# EAGLE schematic Nano_V2-2 (EAGLE 9.6.2)
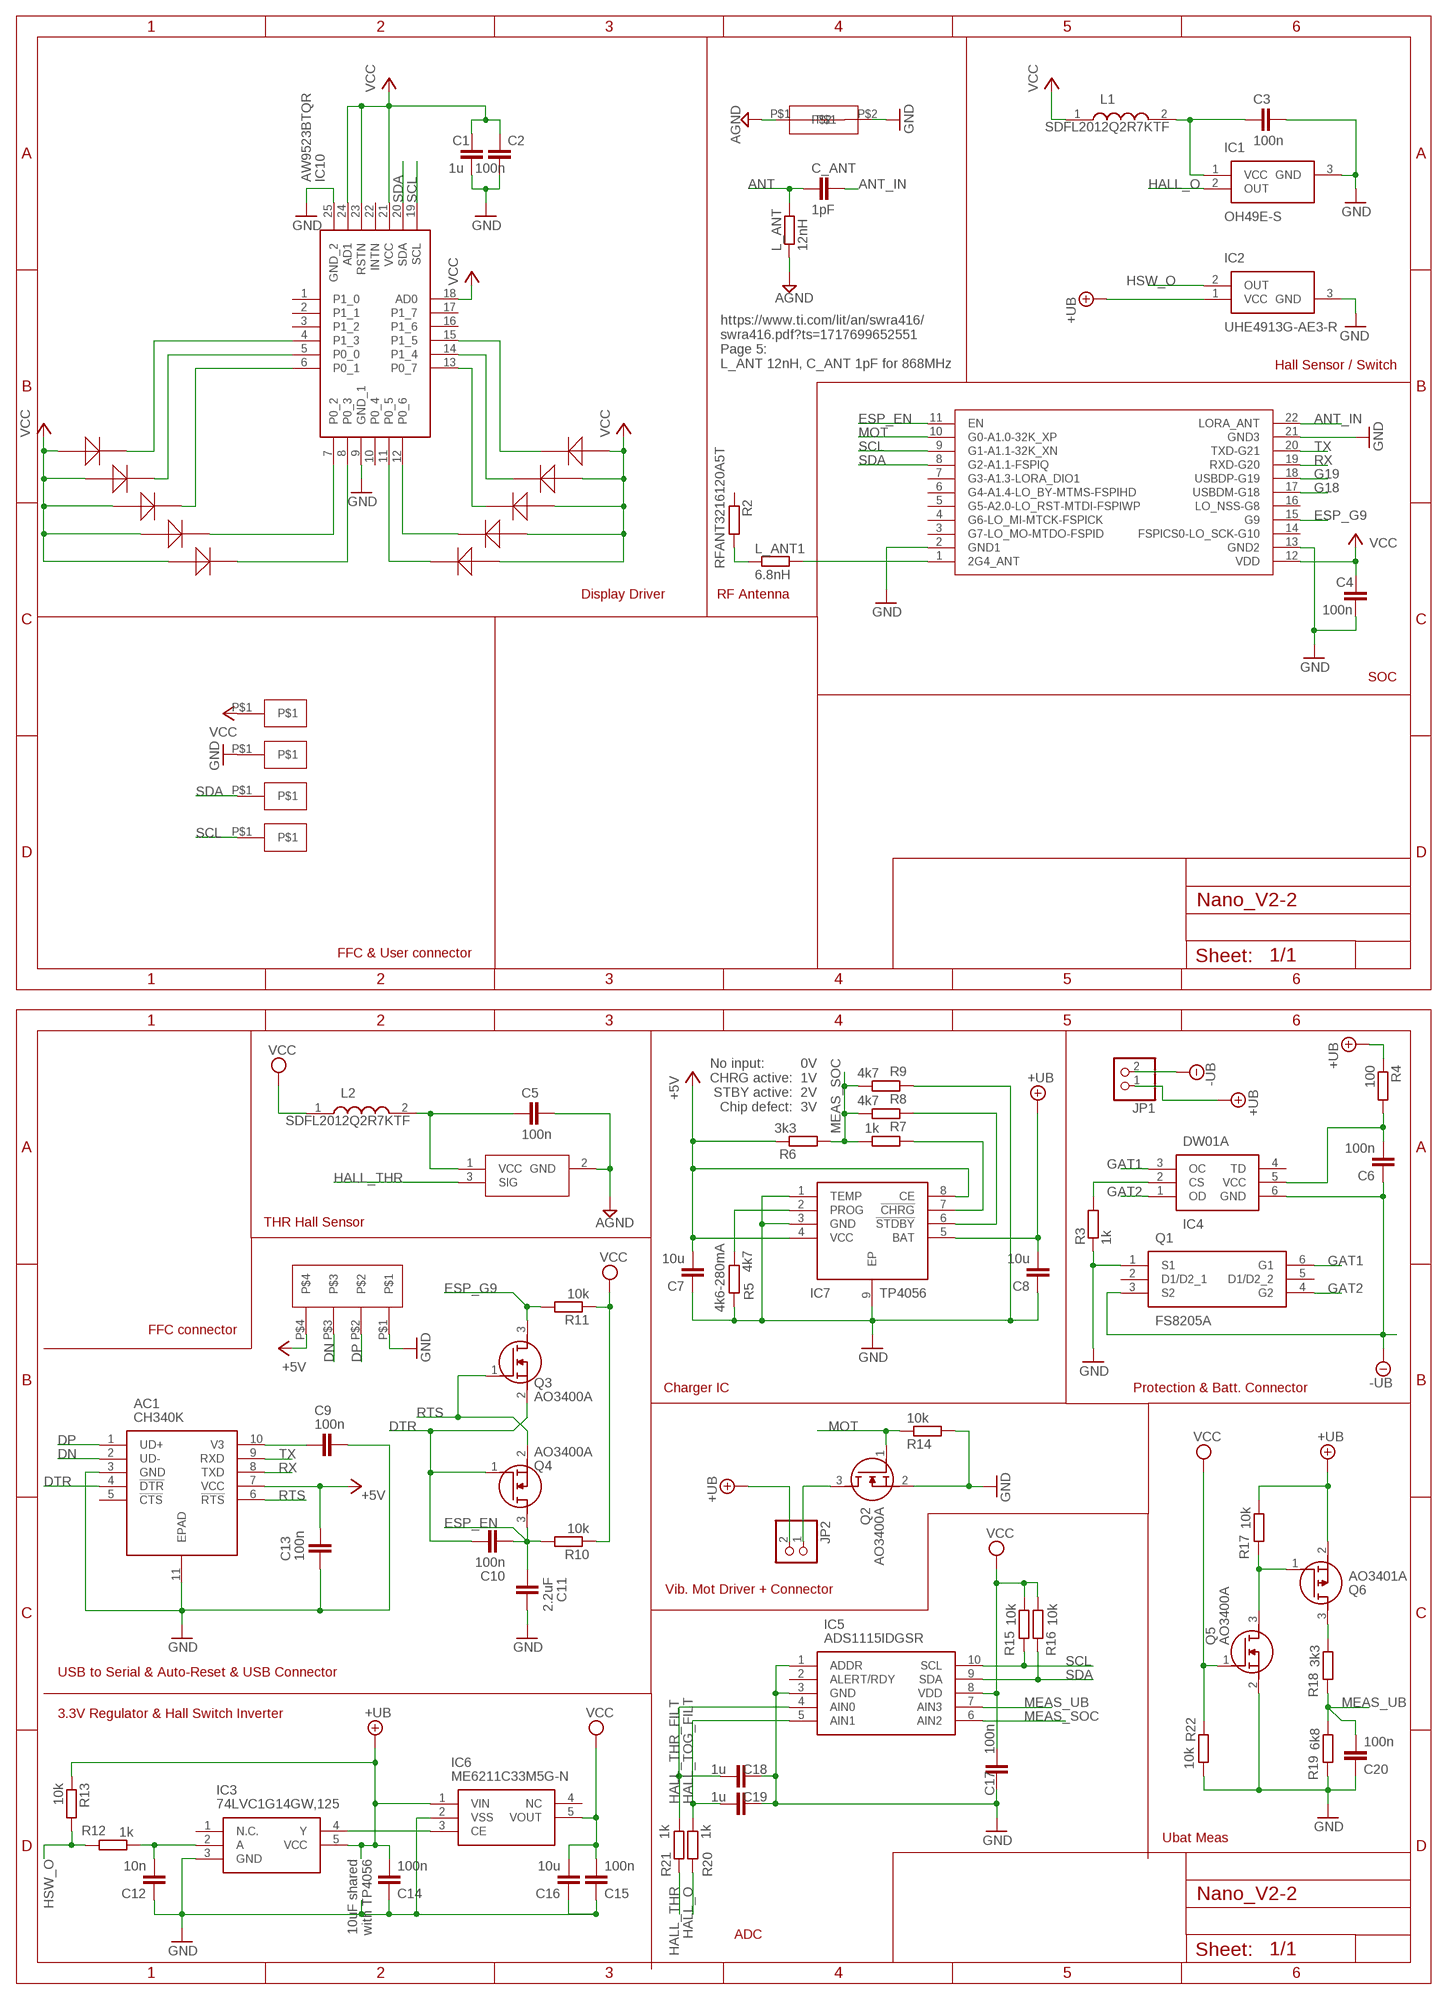
[diagram p0: schematic, sheet 1]

## Parts
AC1  CH340K  [SOP100P600X180-11N]
C1  1u  C-EUC0603  [C0603]
C2  100n  C-EUC0603  [C0603]
C3  100n  C-EUC0603  [C0603]
C4  100n  C-EUC0603  [C0603]
C5  100n  C-EUC0603  [C0603]
C6  100n  C-EUC0603  [C0603]
C7  10u  C-EUC0603  [C0603]
C8  10u  C-EUC0603  [C0603]
C9  100n  C-EUC0603  [C0603]
C10  100n  C-EUC0603  [C0603]
C11  2.2uF  C-EUC0603  [C0603]
C12  10n  C-EUC0603  [C0603]
C13  100n  C-EUC0603  [C0603]
C14  100n  C-EUC0603  [C0603]
C15  100n  C-EUC0603  [C0603]
C16  10u  C-EUC0603  [C0603]
C17  100n  C-EUC0603  [C0603]
C18  1u  C-EUC0603  [C0603]
C19  1u  C-EUC0603  [C0603]
C20  100n  C-EUC0603  [C0603]
C_ANT  1pF  C-EUC0402  [C0402]
IC1  OH49E-S  DRV5055A3QDBZR  [SOT95P237X112-3N]
IC2  UHE4913G-AE3-R  DRV5055A3QDBZR  [SOT95P237X112-3N]
IC3  74LVC1G14GW,125  [SOT65P212X110-5N]
IC4  DW01A  DW01A-G  [SOT95P280X135-6N]
IC5  ADS1115IDGSR  [SOP50P490X110-10N]
IC6  ME6211C33M5G-N  ME6211C50M5G  [SOT95P282X145-5N]
IC7  TP4056  TP4056-42-ESOP8  [SOIC127P600X175-9N]
IC10  AW9523BTQR  [QFN50P400X400X80-25N]
JP1  PINHD-1X2  [1X02]
JP2  PINHD-1X2  [1X02]
L1  SDFL2012Q2R7KTF  [INDC2112X105N]
L2  SDFL2012Q2R7KTF  [INDC2112X105N]
L_ANT  12nH  R-EU_R0402  [R0402]
L_ANT1  6.8nH  R-EU_R0402  [R0402]
Q1  FS8205A  [SOT95P280X125-6N]
Q2  AO3400A  [SOT95P280X125-3N]
Q3  AO3400A  [SOT95P280X125-3N]
Q4  AO3400A  [SOT95P280X125-3N]
Q5  AO3400A  [SOT95P280X125-3N]
Q6  AO3401A  [SOT95P280X125-3N]
R2  RFANT3216120A5T  R-EU_R1206  [R1206]
R3  1k  R-EU_R0603  [R0603]
R4  100  R-EU_R0603  [R0603]
R5  4k7  R-EU_R0603  [R0603]
R6  3k3  R-EU_R0603  [R0603]
R7  1k  R-EU_R0603  [R0603]
R8  4k7  R-EU_R0603  [R0603]
R9  4k7  R-EU_R0603  [R0603]
R10  10k  R-EU_R0603  [R0603]
R11  10k  R-EU_R0603  [R0603]
R12  1k  R-EU_R0603  [R0603]
R13  10k  R-EU_R0603  [R0603]
R14  10k  R-EU_R0603  [R0603]
R15  10k  R-EU_R0603  [R0603]
R16  10k  R-EU_R0603  [R0603]
R17  10k  R-EU_R0603  [R0603]
R18  3k3  R-EU_R0603  [R0603]
R19  6k8  R-EU_R0603  [R0603]
R20  1k  R-EU_R0603  [R0603]
R21  1k  R-EU_R0603  [R0603]
R22  10k  R-EU_R0603  [R0603]
U$1  LED_3MM_BIG_HOLE  [3MM_BIG_HOLE]
U$2  LED_3MM_BIG_HOLE  [3MM_BIG_HOLE]
U$3  LED_3MM_BIG_HOLE  [3MM_BIG_HOLE]
U$4  LED_3MM_BIG_HOLE  [3MM_BIG_HOLE]
U$5  HT-CT62  [HT-CT62]
U$6  LED_3MM_BIG_HOLE  [3MM_BIG_HOLE]
U$7  NETTIE_0.6MM  [0.6MM]
U$8  OH49  [OH49]
U$9  LED_3MM_BIG_HOLE  [3MM_BIG_HOLE]
U$10  LED_3MM_BIG_HOLE  [3MM_BIG_HOLE]
U$11  LED_3MM_BIG_HOLE  [3MM_BIG_HOLE]
U$12  1P  [1PAD]
U$13  1P  [1PAD]
U$14  4P  [4PAD]
U$15  LED_3MM_BIG_HOLE  [3MM_BIG_HOLE]
U$16  LED_3MM_BIG_HOLE  [3MM_BIG_HOLE]
U$17  1P  [1PAD]
U$18  1P  [1PAD]

## Nets
+5V: AC1.7(VCC) C7.2 C13.1 IC7.4(VCC) IC7.8(CE) R6.2 U$14.P$4
+UB: C8.2 C14.2 IC2.1(VCC) IC3.5(VCC) IC6.1(VIN) IC7.5(BAT) JP1.1 JP2.2 Q6.2(S) R4.1 R13.1 R17.1
-UB: C6.1 IC4.6(GND) JP1.2 Q1.3(S2)
AGND: C5.1 L_ANT.1 U$7.P$1 U$8.2(GND)
ANT: C_ANT.1 L_ANT.2
ANT_IN: C_ANT.2 U$5.22(LORA_ANT)
DN: AC1.2(UD-) U$14.P$3
DP: AC1.1(UD+) U$14.P$2
DTR: AC1.4(!DTR) C10.1 Q3.2(S) Q4.1(G)
ESP_EN: C10.2 C11.2 Q4.3(D) R10.2 U$5.11(EN)
ESP_G9: Q3.3(D) R11.2 U$5.15(G9)
G18: U$5.17(USBDM-G18)
G19: U$5.18(USBDP-G19)
GAT1: IC4.3(OC) Q1.6(G1)
GAT2: IC4.1(OD) Q1.4(G2)
GND: AC1.3(GND) AC1.11(EPAD) C1.2 C2.2 C3.1 C4.2 C7.1 C8.1 C9.1 C11.1 C12.1 C13.2 C14.1 C15.1 C16.1 C17.2 C18.2 C19.2 C20.1 IC1.3(GND) IC2.3(GND) IC3.3(GND) IC5.1(ADDR) IC5.3(GND) IC6.2(VSS) IC7.1(TEMP) IC7.3(GND) IC7.9(EP) IC10.9(GND_1) IC10.25(GND_2) Q1.1(S1) Q2.2(S) Q5.2(S) R3.1 R5.1 R9.1 R14.2 R19.2 R22.1 U$5.2(GND1) U$5.13(GND2) U$5.21(GND3) U$7.P$2 U$13.P$1 U$14.P$1
HALL_O: IC1.2(OUT) R20.2
HALL_THR: R21.2 U$8.3(SIG)
HALL_THR_FILT: C18.1 IC5.4(AIN0) R21.1
HALL_TOG_FILT: C19.1 IC5.5(AIN1) R20.1
HALL_V: C3.2 IC1.1(VCC) L1.2
HSW_O: IC2.2(OUT) R12.2 R13.2
MEAS_SOC: IC5.6(AIN2) R6.1 R7.2 R8.2 R9.2
MEAS_UB: C20.2 IC5.7(AIN3) R18.2 R19.1
MOT: Q2.1(G) R14.1 U$5.10(G0-A1.0-32K_XP)
N$1: L_ANT1.2 R2.2
N$2: L_ANT1.1 U$5.1(2G4_ANT)
N$3: IC10.11(P0_5) U$1.P$2(K)
N$4: IC10.12(P0_6) U$2.P$2(K)
N$5: IC10.13(P0_7) U$4.P$2(K)
N$6: IC10.14(P1_4) U$6.P$2(K)
N$7: IC10.15(P1_5) U$3.P$2(K)
N$9: IC10.8(P0_3) U$9.P$2(K)
N$10: IC10.7(P0_2) U$10.P$2(K)
N$11: IC10.6(P0_1) U$11.P$2(K)
N$12: IC10.5(P0_0) U$15.P$2(K)
N$13: IC10.4(P1_3) U$16.P$2(K)
N$20: IC7.2(PROG) R5.2
N$21: C6.2 IC4.5(VCC) R4.2
N$22: AC1.10(V3) C9.2
N$23: IC7.7(!CHRG) R7.1
N$24: IC4.2(CS) R3.2
N$25: IC7.6(!STDBY) R8.1
N$26: IC3.4(Y) IC6.3(CE)
N$27: C5.2 L2.2 U$8.1(VCC)
N$28: C12.2 IC3.2(A) R12.1
N$29: JP2.1 Q2.3(D)
N$32: Q5.3(D) Q6.1(G) R17.2
N$34: Q6.3(D) R18.1
RTS: AC1.6(!RTS) Q3.1(G) Q4.2(S)
RX: AC1.8(TXD) U$5.19(RXD-G20)
SCL: IC5.10(SCL) IC10.19(SCL) R15.2 U$5.9(G1-A1.1-32K_XN) U$18.P$1
SDA: IC5.9(SDA) IC10.20(SDA) R16.2 U$5.8(G2-A1.1-FSPIQ) U$17.P$1
TX: AC1.9(RXD) U$5.20(TXD-G21)
VCC: C1.1 C2.1 C4.1 C15.2 C16.2 C17.1 IC5.8(VDD) IC6.5(VOUT) IC10.18(AD0) IC10.21(VCC) IC10.23(RSTN) IC10.24(AD1) L1.1 L2.1 Q5.1(G) R10.1 R11.1 R15.1 R16.1 R22.2 U$1.P$1(A) U$2.P$1(A) U$3.P$1(A) U$4.P$1(A) U$5.12(VDD) U$6.P$1(A) U$9.P$1(A) U$10.P$1(A) U$11.P$1(A) U$12.P$1 U$15.P$1(A) U$16.P$1(A)
Unconnected: AC1.5(!CTS) IC3.1(N.C.) IC4.4(TD) IC5.2(ALERT/RDY) IC6.4(NC) IC10.1(P1_0) IC10.2(P1_1) IC10.3(P1_2) IC10.10(P0_4) IC10.16(P1_6) IC10.17(P1_7) IC10.22(INTN) Q1.2(D1/D2_1) Q1.5(D1/D2_2) R2.1 U$5.3(G7-LO_MO-MTDO-FSPID) U$5.4(G6-LO_MI-MTCK-FSPICK) U$5.5(G5-A2.0-LO_RST-MTDI-FSPIWP) U$5.6(G4-A1.4-LO_BY-MTMS-FSPIHD) U$5.7(G3-A1.3-LORA_DIO1) U$5.14(FSPICS0-LO_SCK-G10) U$5.16(LO_NSS-G8)

## Notes on the sheet
- Hall Sensor / Switch
- https://www.ti.com/lit/an/swra416/
  swra416.pdf?ts=1717699652551
  Page 5:
  L_ANT 12nH, C_ANT 1pF for 868MHz
- Display Driver | RF Antenna
- SOC
- FFC & User connector
- No input:         0V
  CHRG active:  1V
  STBY active:  2V
  Chip defect:  3V
- THR Hall Sensor
- 4k6-280mA
- FFC connector
- Charger IC | Protection & Batt. Connector
- Vib. Mot Driver + Connector
- USB to Serial & Auto-Reset & USB Connector
- 3.3V Regulator & Hall Switch Inverter
- Ubat Meas
- 10uF shared
  with TP4056
- ADC

## Library data of the parts
AC1 = CH340K:CH340K: CH340 USB2Serial Source: Datasheet <https://akizukidenshi.com/download/ds/wch/ch340.pdf>; DESCRIPTION: CH340 USB2Serial; HEIGHT: 1.8mm; MANUFACTURER_NAME: WCH; MANUFACTURER_PART_NUMBER: CH340K
C1-C20 C_ANT = rcl:C-EU: CAPACITOR, European symbol; SPICEPREFIX: C
IC1 IC2 = DRV5055A3QDBZR:DRV5055A3QDBZR: Hall Effect Sensor 1mA Ratiometric 3.3V/5V 3-Pin SOT-23 T/R Source: Datasheet <http://www.ti.com/general/docs/suppproductinfo.tsp?distId=10&gotoUrl=http://www.ti.com/lit/gpn/drv5055>; ARROW_PART_NUMBER: DRV5055A3QDBZR; ARROW_PRICE-STOCK: https://www.arrow.com/en/products/drv5055a3qdbzr/texas-instruments; DESCRIPTION: Hall Effect Sensor 1mA Ratiometric 3.3V/5V 3-Pin SOT-23 T/R; HEIGHT: 1.12mm; MANUFACTURER_NAME: Texas Instruments; MANUFACTURER_PART_NUMBER: DRV5055A3QDBZR; MOUSER_PART_NUMBER: 595-DRV5055A3QDBZR; MOUSER_PRICE-STOCK: https://www.mouser.co.uk/ProductDetail/Texas-Instruments/DRV5055A3QDBZR?qs=rrS6PyfT74dO6qwrOH6T8w%3D%3D
IC3 = 74LVC1G14GW_125:74LVC1G14GW,125: 74LVC1G14GW,125, Schmitt Trigger Inverter, LVC, 32mA 1.65 to 5.5V 5-Pin TSSOP Source: Datasheet <https://assets.nexperia.com/documents/data-sheet/74LVC1G14.pdf>; ARROW_PART_NUMBER: 74LVC1G14GW,125; ARROW_PRICE-STOCK: https://www.arrow.com/en/products/74lvc1g14gw125/nexperia?region=nac; DESCRIPTION: 74LVC1G14GW,125, Schmitt Trigger Inverter, LVC, 32mA 1.65 to 5.5V 5-Pin TSSOP; HEIGHT: 1.1mm; MANUFACTURER_NAME: Nexperia; MANUFACTURER_PART_NUMBER: 74LVC1G14GW,125; MOUSER_PART_NUMBER: 771-74LVC1G14GW-G; MOUSER_PRICE-STOCK: https://www.mouser.co.uk/ProductDetail/Nexperia/74LVC1G14GW125?qs=me8TqzrmIYVaj3J%252BEdq4Gw%3D%3D
IC4 = DW01A-G:DW01A-G: One Cell Lithium-ion/Polymer Battery Protection IC Source: Datasheet <http://acoptex.com/uploads/DW01A.pdf>; DESCRIPTION: One Cell Lithium-ion/Polymer Battery Protection IC; HEIGHT: 1.35mm; MANUFACTURER_NAME: Fortune Semiconductor Corporation; MANUFACTURER_PART_NUMBER: DW01A-G
IC5 = ADS1115IDGSR:ADS1115IDGSR: 16-Bit 860SPS 4-Ch Delta-Sigma ADC With PGA, Oscillator, Vref, Comparator, and I2C Source: Datasheet <http://www.ti.com/lit/gpn/ADS1115>; ARROW_PART_NUMBER: ADS1115IDGSR; ARROW_PRICE-STOCK: https://www.arrow.com/en/products/ads1115idgsr/texas-instruments?utm_currency=USD&region=nac; DESCRIPTION: 16-Bit 860SPS 4-Ch Delta-Sigma ADC With PGA, Oscillator, Vref, Comparator, and I2C; HEIGHT: 1.1mm; MANUFACTURER_NAME: Texas Instruments; MANUFACTURER_PART_NUMBER: ADS1115IDGSR; MOUSER_PART_NUMBER: 595-ADS1115IDGSR; MOUSER_PRICE-STOCK: https://www.mouser.co.uk/ProductDetail/Texas-Instruments/ADS1115IDGSR?qs=IK5e5L0zOXjKCJoVMhYO%2FQ%3D%3D
IC6 = ME6211C50M5G:ME6211C50M5G: ME6211C50M5G Source: Datasheet <https://atta.szlcsc.com/upload/public/pdf/source/20180709/C236670_CE73D272779D26EBD8CFC2246415DB9C.pdf>; DESCRIPTION: ME6211C50M5G; HEIGHT: 1.45mm; MANUFACTURER_NAME: Microne; MANUFACTURER_PART_NUMBER: ME6211C50M5G
IC7 = TP4056-42-ESOP8:TP4056-42-ESOP8: PMIC - Battery Management ESOP-8 RoHS Source: Datasheet <https://datasheet.lcsc.com/szlcsc/1906261508_Nanjing-Extension-Microelectronics-TP4056-42-ESOP8_C16581.pdf>; DESCRIPTION: PMIC - Battery Management ESOP-8 RoHS; HEIGHT: 1.75mm; MANUFACTURER_NAME: Nanjing Extension Microelectronics; MANUFACTURER_PART_NUMBER: TP4056-42-ESOP8
IC10 = AW9523BTQR:AW9523BTQR: 16 MULTI-FUNCTION LED DRIVER AND GPIO CONTROLLER WITH I2C INTERFACE Source: Datasheet <https://www.alldatasheet.net/datasheet-pdf/pdf/1148543/AWINIC/AW9523BTQR.html>; DESCRIPTION: 16 MULTI-FUNCTION LED DRIVER AND GPIO CONTROLLER WITH I2C INTERFACE; HEIGHT: 0.8mm; MANUFACTURER_NAME: AWINIC; MANUFACTURER_PART_NUMBER: AW9523BTQR
JP1 JP2 = pinhead:PINHD-1X2: PIN HEADER
L1 L2 = SDFL2012Q2R7KTF:SDFL2012Q2R7KTF: Multi-layer Chip Ferrite Inductor Source: Datasheet <https://datasheet.lcsc.com/szlcsc/Sunlord-SDFL2012Q2R7KTF_C74318.pdf>; DESCRIPTION: Multi-layer Chip Ferrite Inductor; HEIGHT: 1.05mm; MANUFACTURER_NAME: SUNLORD; MANUFACTURER_PART_NUMBER: SDFL2012Q2R7KTF
L_ANT L_ANT1 R2-R22 = rcl:R-EU_: RESISTOR, European symbol; SPICEPREFIX: R
Q1 = FS8205A:FS8205A: Dual N-Channel Enhancement Power Mosfet Source: Datasheet <http://www.techpublic.com.tw/pdf/FS8205A.pdf>; DESCRIPTION: Dual N-Channel Enhancement Power Mosfet; HEIGHT: 1.25mm; MANUFACTURER_NAME: TECH PUBLIC; MANUFACTURER_PART_NUMBER: FS8205A
Q2-Q5 = AO3400A:AO3400A: 30V N-Channel MOSFET Source: Datasheet <http://aosmd.com/res/data_sheets/AO3400A.pdf>; ARROW_PART_NUMBER: AO3400A; ARROW_PRICE-STOCK: https://www.arrow.com/en/products/ao3400a/alpha-and-omega-semiconductor?region=nac; DESCRIPTION: 30V N-Channel MOSFET; HEIGHT: 1.25mm; MANUFACTURER_NAME: Alpha & Omega Semiconductors; MANUFACTURER_PART_NUMBER: AO3400A
Q6 = AO3401A:AO3401A: 30V P-Channel MOSFET Source: Datasheet <http://www.aosmd.com/pdfs/datasheet/AO3401A.pdf>; ARROW_PART_NUMBER: AO3401A; ARROW_PRICE-STOCK: https://www.arrow.com/en/products/ao3401a/alpha-and-omega-semiconductor?region=nac; DESCRIPTION: 30V P-Channel MOSFET; HEIGHT: 1.25mm; MANUFACTURER_NAME: Alpha & Omega Semiconductors; MANUFACTURER_PART_NUMBER: AO3401A
U$1-U$4 U$6 U$9-U$11 U$15 U$16 = LED_3mm:LED_3MM_BIG_HOLE
U$5 = HT-CT62:HT-CT62
U$7 = NETTIE:NETTIE_0.6MM
U$8 = OH49:OH49
U$12 U$13 U$17 U$18 = 2-54_PADs:1P
U$14 = 2-54_PADs:4P